# EAGLE design Control_Module_Schematic (EAGLE 7.3.0)
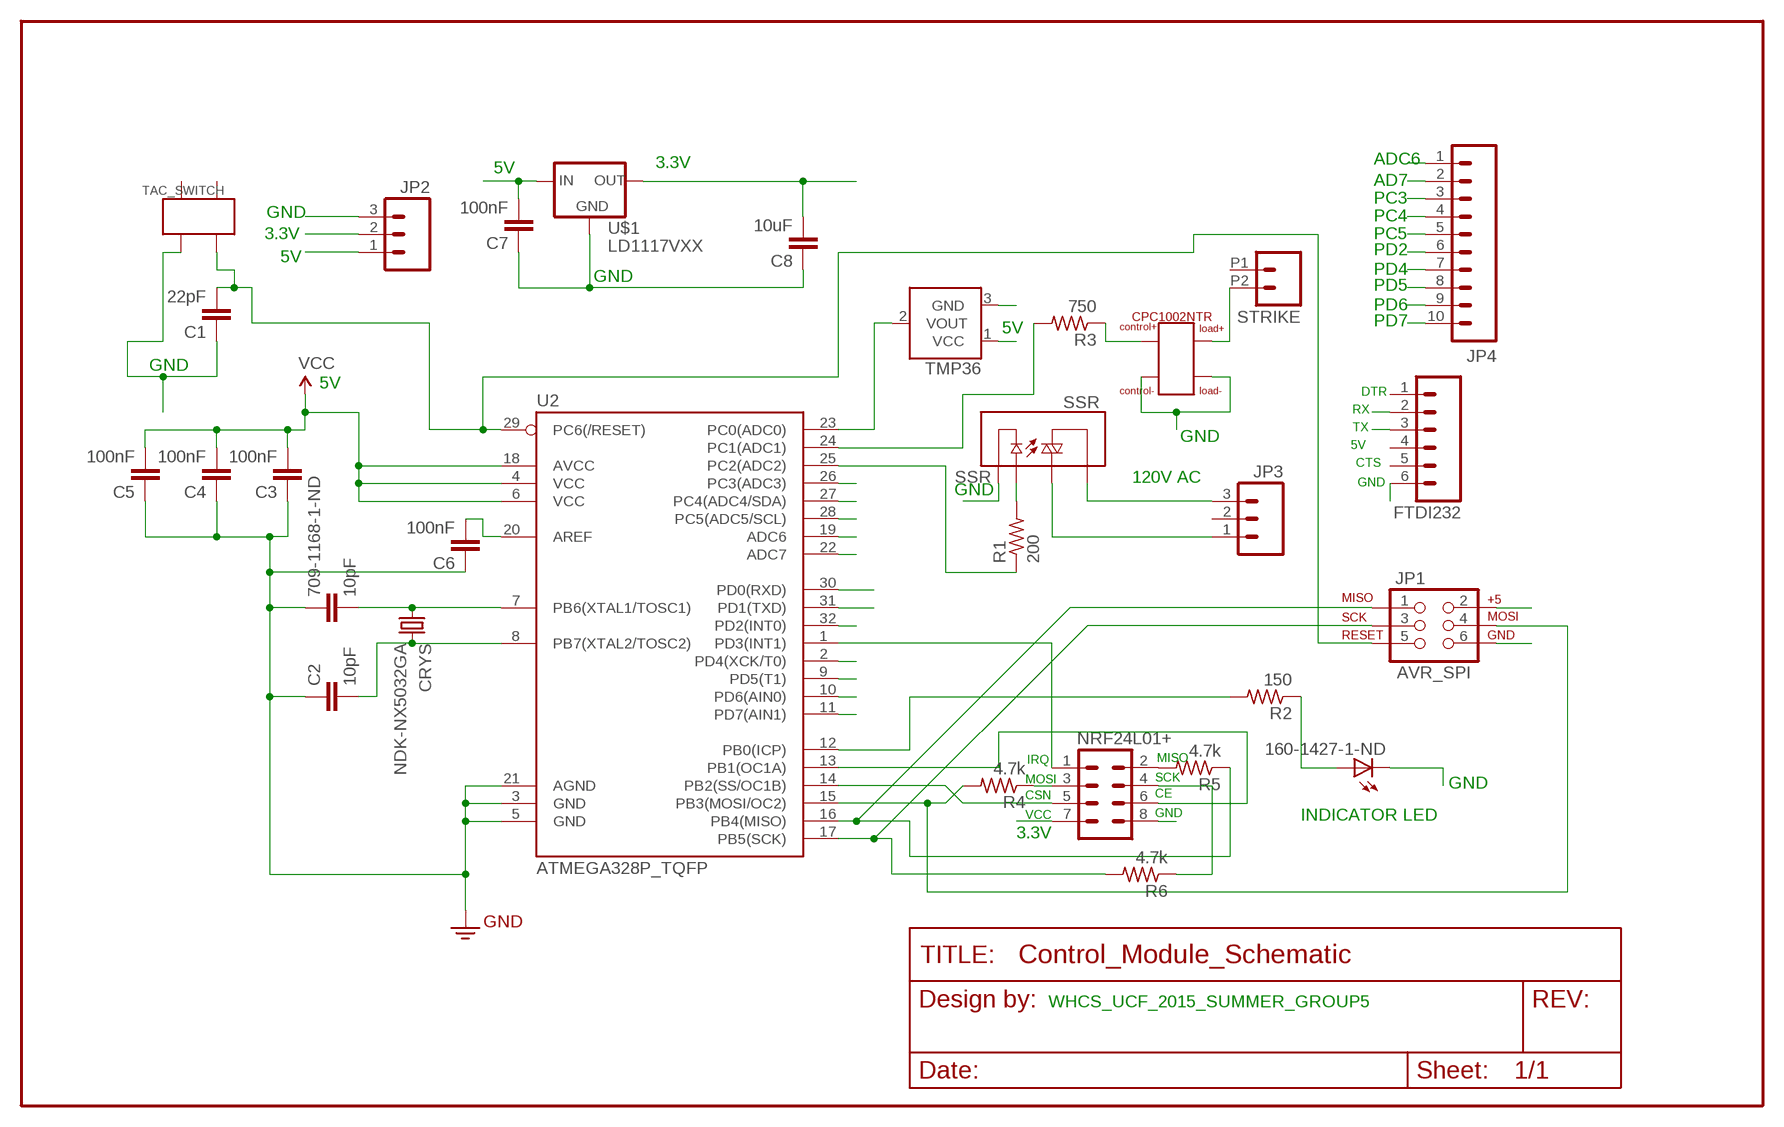
[diagram p0: schematic, sheet 1]

## Parts
160-1427-1-ND  LEDCHIP-LED0805  [CHIP-LED0805]
709-1168-1-ND  10pF  1UF-25V-10%(0805)"  [0805-CAP]
C1  22pF  1UF-25V-10%(0805)"  [0805-CAP]
C2  10pF  1UF-25V-10%(0805)"  [0805-CAP]
C3  100nF  1UF-25V-10%(0805)"  [0805-CAP]
C4  100nF  1UF-25V-10%(0805)"  [0805-CAP]
C5  100nF  1UF-25V-10%(0805)"  [0805-CAP]
C6  100nF  1UF-25V-10%(0805)"  [0805-CAP]
C7  100nF  1UF-25V-10%(0805)"  [0805-CAP]
C8  10uF  1UF-25V-10%(0805)"  [0805-CAP]
CPC1002NTR  CPC1002NTR  [CPC1002N]
CRYS  NDK-NX5032GA  [CRYS-5X3.2]
FRAME1  FRAME-LETTERNO_PACKAGE  [DUMMY]
FTDI232  M06LONGPADS  [1X06_LONGPADS]
JP1  AVR_SPI  AVR_SPI_PRG_6NS  [2X3-NS]
JP2  M03-SCREW-5MM  [SCREWTERMINAL-5MM-3]
JP3  M03-SCREW-5MM  [SCREWTERMINAL-5MM-3]
JP4  M10LOCK_LONGPADS  [1X10_LOCK_LONGPADS]
NRF24L01+  M04X2  [2X4]
R1  200  R-US_R0805  [R0805]
R2  150  R-US_R0805  [R0805]
R3  750  R-US_R0805  [R0805]
R4  4.7k  R-US_R0805  [R0805]
R5  4.7k  R-US_R0805  [R0805]
R6  4.7k  R-US_R0805  [R0805]
SSR  SSR  RELAY-SOLIDSTATE  [RELAY-S116S02F]
STRIKE  M022.54MM_SCREWTERM  [1X02_2.54_SCREWTERM]
TAC_SWITCH  TACTILE_SWITCH  [TAC_SWITCH_GULL_WING]
TMP36  TMP36TO-92-KIT  [TO-92-KIT]
U2  ATMEGA328P_TQFP  [TQFP32-08]
U$1  LD1117VXX  V_REG_LD1117VXX  [78XXL]

## Nets
3.3V: C8.2 JP2.2 NRF24L01+.7 U$1.OUT
5V: C3.2 C4.2 C5.2 C7.2 JP1.2 JP2.1 TMP36.1(VCC) U2.4(VCC) U2.6(VCC) U2.18(AVCC) U$1.IN ; supply symbol labelled VCC
ADC6: JP4.1 U2.19(ADC6)
ADC7: JP4.2 U2.22(ADC7)
GND: 160-1427-1-ND.C 709-1168-1-ND.1 C1.1 C2.1 C3.1 C4.1 C5.1 C6.1 C7.1 C8.1 CPC1002NTR.P$1 CPC1002NTR.P$4 FTDI232.6 JP1.6 JP2.3 NRF24L01+.8 SSR.P$4(-) TAC_SWITCH.P$2 TMP36.3(GND) U2.3(GND) U2.5(GND) U2.21(AGND) U$1.GND ; supply symbol labelled GND2
N$1: NRF24L01+.5 U2.14(PB2(SS/OC1B))
N$2: JP1.1 R5.1 U2.16(PB4(MISO))
N$3: JP1.4 R4.2 U2.15(PB3(MOSI/OC2))
N$4: JP1.3 R6.2 U2.17(PB5(SCK))
N$5: NRF24L01+.1 U2.1(PD3(INT1))
N$6: NRF24L01+.6 U2.13(PB1(OC1A))
N$7: TMP36.2(VOUT) U2.23(PC0(ADC0))
N$8: R1.2 SSR.P$3(+)
N$9: R1.1 U2.25(PC2(ADC2))
N$10: JP3.3 SSR.P$1(T1)
N$11: JP3.1 SSR.P$2(T2)
N$12: R3.2 U2.24(PC1(ADC1))
N$13: CPC1002NTR.P$2(CONTROL+) R3.1
N$14: 709-1168-1-ND.2 CRYS.P$1 U2.7(PB6(XTAL1/TOSC1))
N$15: C2.2 CRYS.P$2 U2.8(PB7(XTAL2/TOSC2))
N$16: R2.2 U2.12(PB0(ICP))
N$17: 160-1427-1-ND.A R2.1
N$18: CPC1002NTR.P$3 STRIKE.P2
N$20: NRF24L01+.3 R4.1
N$21: NRF24L01+.2 R5.2
N$22: NRF24L01+.4 R6.1
N$23: C6.2 U2.20(AREF)
N$24: C1.2 JP1.5 TAC_SWITCH.P$4 U2.29(PC6(/RESET))
PC3: JP4.3 U2.26(PC3(ADC3))
PC4: JP4.4 U2.27(PC4(ADC4/SDA))
PC5: JP4.5 U2.28(PC5(ADC5/SCL))
PD2: JP4.6 U2.32(PD2(INT0))
PD4: JP4.7 U2.2(PD4(XCK/T0))
PD5: JP4.8 U2.9(PD5(T1))
PD6: JP4.9 U2.10(PD6(AIN0))
PD7: JP4.10 U2.11(PD7(AIN1))
RXD: FTDI232.3 U2.30(PD0(RXD))
TXD: FTDI232.2 U2.31(PD1(TXD))
Unconnected: FTDI232.1 FTDI232.4 FTDI232.5 JP3.2 STRIKE.P1 TAC_SWITCH.P$1 TAC_SWITCH.P$3

## Notes on the sheet
- 3.3V | ADC6
- 5V
- AD7
- PC3
- GND | PC4
- 3.3V | PC5
- PD2
- 5V
- PD4
- GND
- PD5
- PD6
- PD7
- 5V
- GND
- 5V
- DTR
- RX
- TX
- GND
- 5V
- CTS
- 120V AC
- GND
- GND
- IRQ | MISO
- MOSI | SCK
- GND
- CSN | CE
- VCC | GND | INDICATOR LED
- 3.3V
- WHCS_UCF_2015_SUMMER_GROUP5

## Library data of the parts
160-1427-1-ND = led:LED: LED OSRAM: - CHIPLED LG R971, LG N971, LY N971, LG Q971, LY Q971, LO R971, LY R971 LH N974, LH R974 LS Q976, LO Q976, LY Q976 LO Q996 - Hyper CHIPLED LW Q18S LB Q993, LB Q99A, LB R99A - SideLED LS A670, LO A670, LY A670, LG A670, LP A670 LB A673, LV A673, LT A673, LW A673 LH A674 LY A675 LS A676, LA A676, LO A676, LY A676, LW A676 LS A679, LY A679, LG A679 - Hyper Micro SIDELED® LS Y876, LA Y876, LO Y876, LY Y876 LT Y87S - SmartLED LW L88C, LW L88S LB L89C, LB L89S, LG L890 LS L89K, LO L89K, LY L89K LS L896, LA L896, LO L896, LY L896 - TOPLED LS T670, LO T670, LY T670, LG T670, LP T670 LSG T670, LSP T670, LSY T670, LOP T670, LYG T670 LG T671, LOG T671, LSG T671 LB T673, LV T673, LT T673, LW T673 LH T674 LS T676, LA T676, LO T676, LY T676, LB T676, LH T676, LSB T676, LW T676 LB T67C, LV T67C, LT T67C, LS T67K, LO T67K, LY T67K, LW E67C LS E67B, LA E67B, LO E67B, LY E67B, LB E67C, LV E67C, LT E67C LW T67C LS T679, LY T679, LG T679 LS T770, LO T770, LY T770, LG T770, LP T770 LB T773, LV T773, LT T773, LW T773 LH T774 LS E675, LA E675, LY E675, LS T675 LS T776, LA T776, LO T776, LY T776, LB T776 LHGB T686 LT T68C, LB T68C - Hyper Mini TOPLED® LB M676 - Mini TOPLED Santana® LG M470 LS M47K, LO M47K, LY M47K Source: http://www.osram.convergy.de LUXEON: - LUMILED® LXK2-PW12-R00, LXK2-PW12-S00, LXK2-PW14-U00, LXK2-PW14-V00 LXK2-PM12-R00, LXK2-PM12-S00, LXK2-PM14-U00 LXK2-PE12-Q00, LXK2-PE12-R00, LXK2-PE12-S00, LXK2-PE14-T00, LXK2-PE14-U00 LXK2-PB12-K00, LXK2-PB12-L00, LXK2-PB12-M00, LXK2-PB14-N00, LXK2-PB14-P00, LXK2-PB14-Q00 LXK2-PR12-L00, LXK2-PR12-M00, LXK2-PR14-Q00, LXK2-PR14-R00 LXK2-PD12-Q00, LXK2-PD12-R00, LXK2-PD12-S00 LXK2-PH12-R00, LXK2-PH12-S00 LXK2-PL12-P00, LXK2-PL12-Q00, LXK2-PL12-R00 Source: www.luxeon.com KINGBRIGHT: KA-3528ASYC Source: www.kingbright.com
709-1168-1-ND C1-C8 = SparkFun-Capacitors:1UF-25V-10%(0805): CAP-08064
CPC1002NTR = WHCS:CPC1002NTR
CRYS = WHCS:NDK-NX5032GA
FRAME1 = WHCS:FRAME-LETTER: Schematic Frame Standard 8.5x11 US Letter frame; DESIGNER: Nobody; VERSION: v01
FTDI232 = SparkFun-Connectors:M06: Header 6 Standard 6-pin 0.1" header. Use with straight break away headers (SKU : PRT-00116), right angle break away headers (PRT-00553), swiss pins (PRT-00743), machine pins (PRT-00117), and female headers (PRT-00115). Molex polarized connector foot print use with SKU : PRT-08094 with associated crimp pins and housings. NOTES ON THE VARIANTS LOCK and LOCK_LONGPADS... This footprint was designed to help hold the alignment of a through-hole component (i.e. 6-pin header) while soldering it into place. You may notice that each hole has been shifted either up or down by 0.005 of an inch from it's more standard position (which is a perfectly straight line). This slight alteration caused the pins (the squares in the middle) to touch the edges of the holes. Because they are alternating, it causes a "brace" to hold the component in place. 0.005 has proven to be the perfect amount of "off-center" position when using our standard breakaway headers. Although looks a little odd when you look at the bare footprint, once you have a header in there, the alteration is very hard to notice. Also,if you push a header all the way into place, it is covered up entirely on the bottom side. This idea of altering the position of holes to aid alignment will be further integrated into the Sparkfun Library for other footprints. It can help hold any component with 3 or more connection pins.
JP1 = SparkFun-Connectors:AVR_SPI_PRG_6: AVR ISP 6 Pin This is the reduced ISP connector for AVR programming. Common on Arduino. This footprint will take up less PCB space and can be used with a 10-pin to 6-pin adapter such as SKU: BOB-08508 **Special note about "TEST_POINT" package. The stop mask is on the top side, so if you want your programming test points to be on the bottom of your board, make sure to place this package on the bottom side of the board. This also ensure that the orientation to program from the bottom side will be correct.
JP2 JP3 = SparkFun-Connectors:M03: Header 3 Standard 3-pin 0.1" header. Use with straight break away headers (SKU : PRT-00116), right angle break away headers (PRT-00553), swiss pins (PRT-00743), machine pins (PRT-00117), and female headers (PRT-00115). Molex polarized connector foot print use with SKU : PRT-08232 with associated crimp pins and housings.; STOREFRONT_ID: PRT-08433
JP4 = SparkFun-Connectors:M10: Header 10 Standard 10-pin 0.1" header. Use with straight break away headers (SKU : PRT-00116), right angle break away headers (PRT-00553), swiss pins (PRT-00743), machine pins (PRT-00117), and female headers (PRT-00115).
NRF24L01+ = SparkFun-Connectors:M04X2: .1" header, two rows of four.
R1-R6 = rcl:R-US_: RESISTOR, American symbol
SSR = WHCS:RELAY-SOLIDSTATE: SPST SS relay
STRIKE = SparkFun-Connectors:M02: Standard 2-pin 0.1" header. Use with - straight break away headers ( PRT-00116) - right angle break away headers (PRT-00553) - swiss pins (PRT-00743) - machine pins (PRT-00117) - female headers (PRT-00115) Molex polarized connector foot print use with: PRT-08233 with associated crimp pins and housings. 2.54_SCREWTERM for use with PRT-10571. 3.5mm Screw Terminal footprints for PRT-08084 5mm Screw Terminal footprints for use with PRT-08432
TAC_SWITCH = WHCS:TACTILE_SWITCH
TMP36 = SparkFun-Sensors:TMP36: Precision degC temp sensor, analog out
U2 = SparkFun-DigitalIC:ATMEGA328P_TQFP; PROD_ID: IC-09069
U$1 = SparkFun-PowerIC:V_REG_LD1117VXX: LD1117VXX voltage regulator. We carry the 3.3V version (COM-00526) in TO-220 package.

## Net classes
0 default: width 0.254 mm

## Board
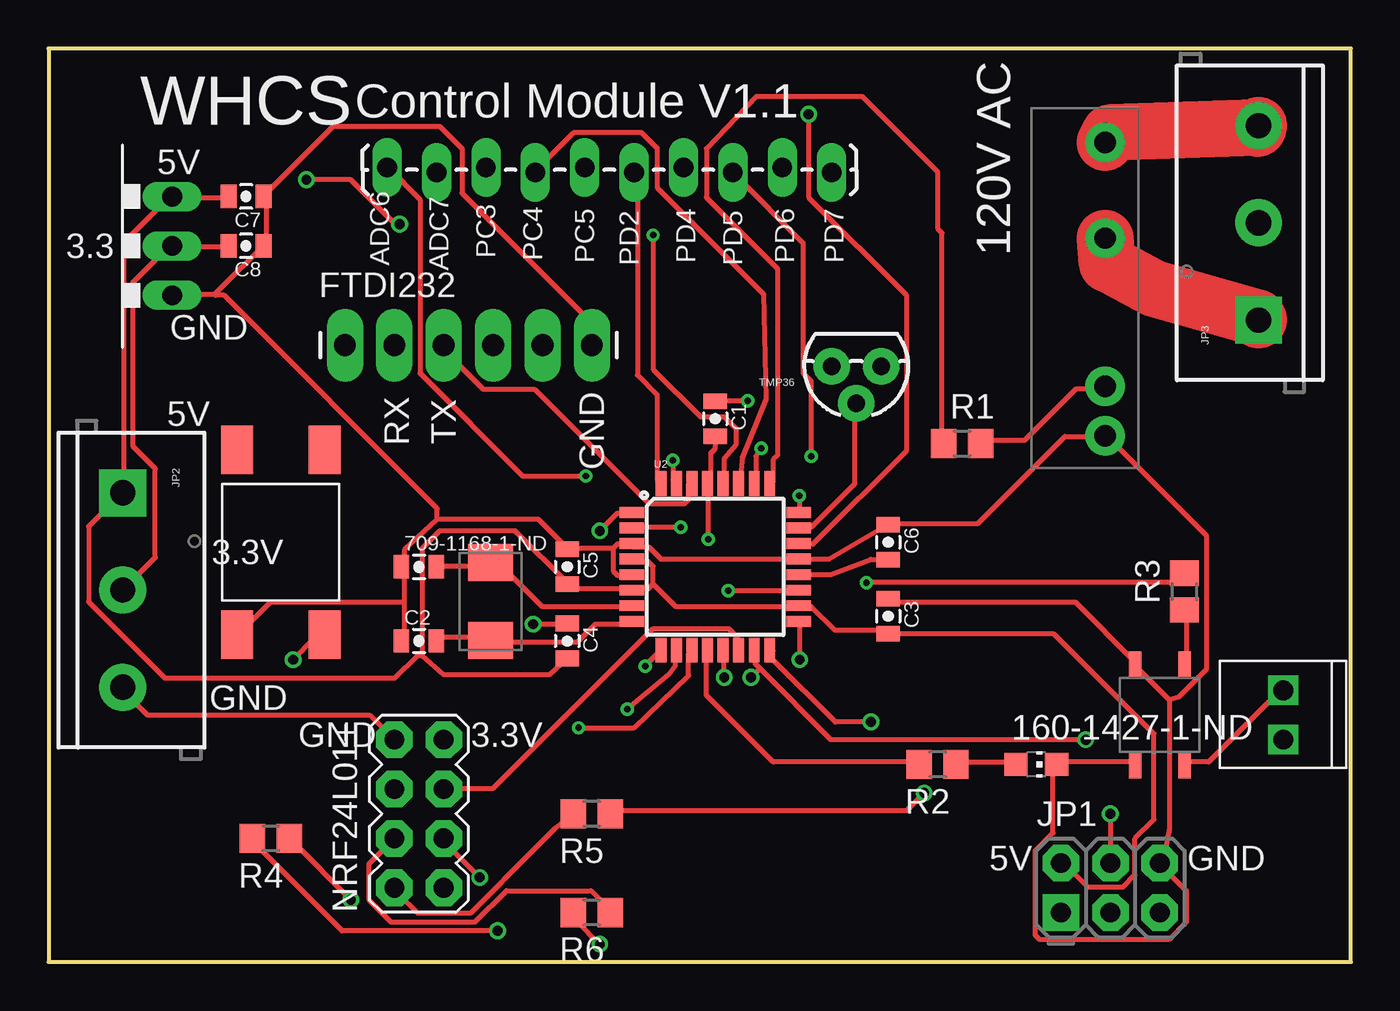
[diagram p1: board, top side]
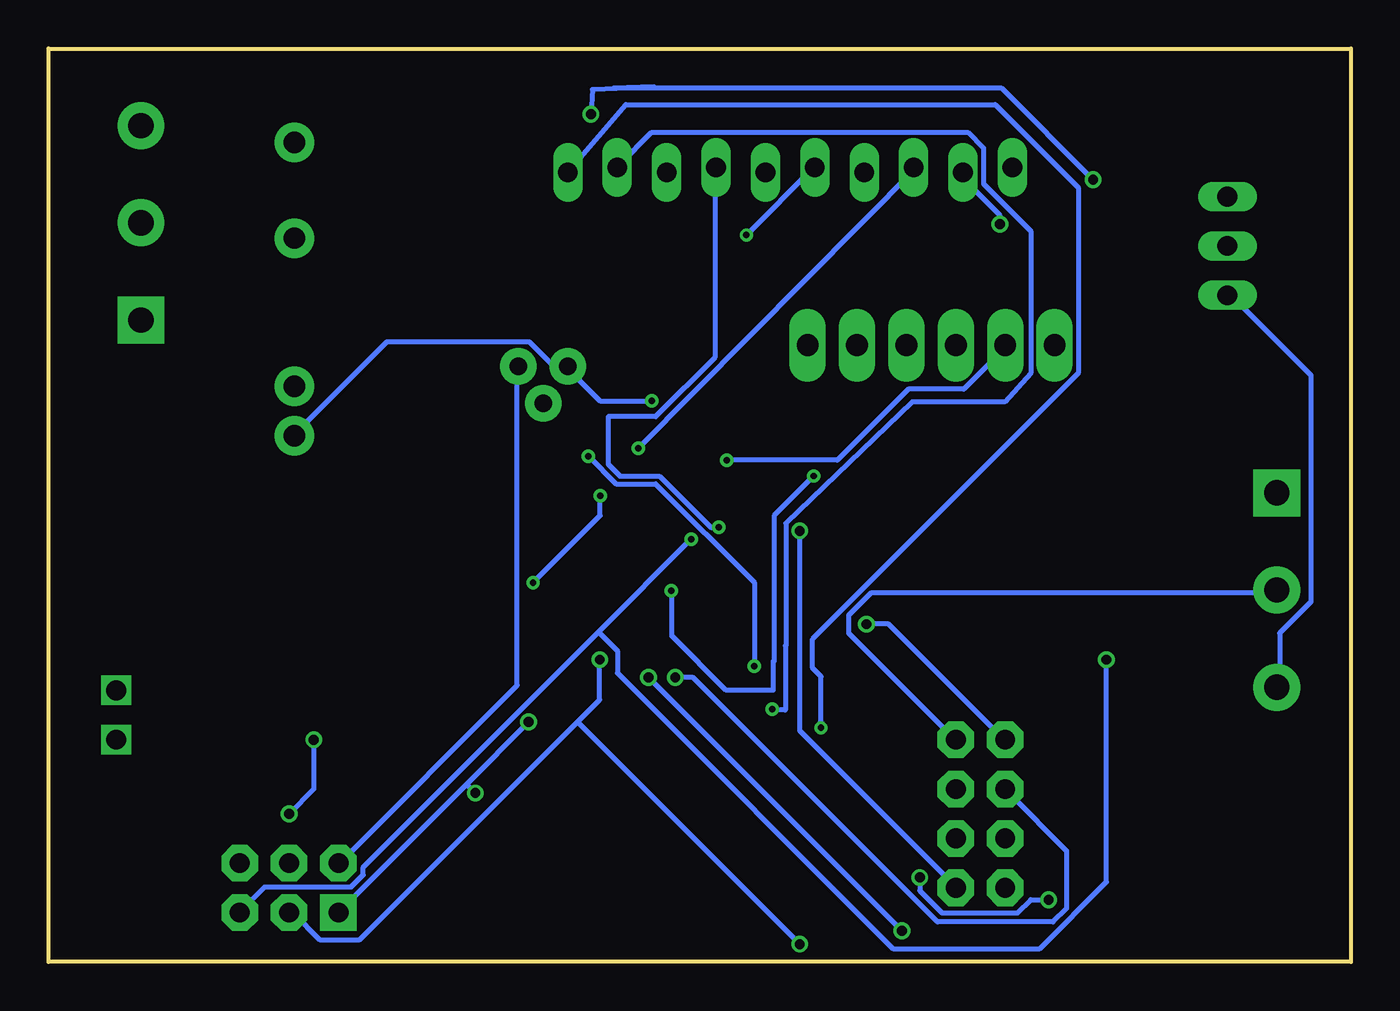
[diagram p2: board, bottom side, seen from below]

Size 66.98 x 46.98 mm. Coordinates in mm from the lower left corner, seen from the top.
Outline: 0,0 66.98,0 66.98,46.98 0,46.98 0,0
Copper layers (1*16): Top 0.0356mm / dielectric 1.5011mm / Bottom 0.0356mm
Design rules "oshpark-2layer": minimum track width 6mil, minimum drill 13mil, track to track 6mil, track to pad 6mil, pad to pad 6mil, via to via 6mil, smd to smd 6mil, copper to edge 15mil, drill to drill 6mil, minimum pad ring 7mil, minimum via ring 7mil, stop-mask expansion 4mil, vias tented up to drill 0mil, thermal gap 10mil

### Footprints (pad centres in the part's own frame; a part is rotated, then mirrored left to right if it is on the bottom)
CHIP-LED0805 = smd 1.2 x 1.2: A 0,-1.05; C 0,1.05
0805-CAP = smd 0.8 x 1.2: 1 -0.9,0; 2 0.9,0
CPC1002N = smd 0.635 x 1.321: P$1 -1.27,2.603; P$2 1.27,2.603; P$3 1.27,-2.603; P$4 -1.27,-2.603
CRYS-5X3.2 = smd 1.9 x 2.3: P$1 -2,0; P$2 2,0
1X06_LONGPADS = drill 1.118 pad 1.88 long: 1 0,0; 2 2.54,0; 3 5.08,0; 4 7.62,0; 5 10.16,0; 6 12.7,0
2X3-NS = drill 1.016 pad 1.88 square: 1 -2.54,-1.27 | drill 1.016 pad 1.88 octagon: 2 -2.54,1.27; 3 0,-1.27; 4 0,1.27; 5 2.54,-1.27; 6 2.54,1.27
SCREWTERMINAL-5MM-3 = drill 1.3 pad 2.413 square: 1 0,0 | drill 1.3 pad 2.413: 2 5,0; 3 10,0
1X10_LOCK_LONGPADS = drill 1.016 long: 1 0,0.127; 2 2.54,-0.127; 3 5.08,0.127; 4 7.62,-0.127; 5 10.16,0.127; 6 12.7,-0.127; 7 15.24,0.127; 8 17.78,-0.127; 9 20.32,0.127; 10 22.86,-0.127
2X4 = drill 1.016 pad 1.88 octagon: 1 -3.81,-1.27; 2 -3.81,1.27; 3 -1.27,-1.27; 4 -1.27,1.27; 5 1.27,-1.27; 6 1.27,1.27; 7 3.81,-1.27; 8 3.81,1.27
R0805 = smd 1.3 x 1.5: 1 -0.95,0; 2 0.95,0
RELAY-S116S02F = drill 1.1 pad 2.032: P$1 -7.5,1.05; P$2 -2.57,1.05; P$3 5.05,1.05; P$4 7.59,1.05
1X02_2.54_SCREWTERM = drill 1.016 square: P1 2.54,0; P2 0,0
TAC_SWITCH_GULL_WING = smd 1.65 x 2.5: P$1 -2.25,4.75; P$2 -2.25,-4.75; P$3 2.25,4.75; P$4 2.25,-4.75
TO-92-KIT = drill 0.9 pad 1.88: 1 -1.27,0; 2 0,1.905; 3 1.27,0
TQFP32-08 = smd 1.27 x 0.559: 1 -4.293,2.8; 2 -4.293,2; 3 -4.293,1.2; 4 -4.293,0.4; 5 -4.293,-0.4; 6 -4.293,-1.2; 7 -4.293,-2; 8 -4.293,-2.8; 17 4.293,-2.8; 18 4.293,-2; 19 4.293,-1.2; 20 4.293,-0.4; 21 4.293,0.4; 22 4.293,1.2; 23 4.293,2; 24 4.293,2.8 | smd 0.559 x 1.27: 9 -2.8,-4.293; 10 -2,-4.293; 11 -1.2,-4.293; 12 -0.4,-4.293; 13 0.4,-4.293; 14 1.2,-4.293; 15 2,-4.293; 16 2.8,-4.293; 25 2.8,4.293; 26 2,4.293; 27 1.2,4.293; 28 0.4,4.293; 29 -0.4,4.293; 30 -1.2,4.293; 31 -2,4.293; 32 -2.8,4.293
78XXL = drill 1.016 long: GND -2.54,-3.81; IN 2.54,-3.81; OUT 0,-3.81

### Placement (x,y rotation side)
160-1427-1-ND  50.8,10.16 270 top
709-1168-1-ND  19.05,20.32 0 top
C1  34.29,27.94 270 top
C2  19.05,16.51 0 top
C3  43.18,17.78 270 top
C4  26.67,16.51 270 top
C5  26.67,20.32 270 top
C6  43.18,21.59 270 top
C7  10.16,39.37 180 top
C8  10.16,36.83 180 top
CPC1002NTR  57.15,12.7 0 top
CRYS  22.73,18.54 270 top
FRAME1  0,-1.27 0 top
FTDI232  15.24,31.72 0 top
JP1  54.61,3.81 0 top
JP2  3.81,24.13 270 top
JP3  62.23,33.02 90 top
JP4  17.41,40.74 0 top
NRF24L01+  19.05,7.62 90 top
R1  46.99,26.67 0 top
R2  45.72,10.16 180 top
R3  58.42,19.05 90 top
R4  11.43,6.35 180 top
R5  27.94,7.62 180 top
R6  27.94,2.54 180 top
SSR  53.29,34.66 270 top
STRIKE  63.5,13.97 270 top
TAC_SWITCH  11.94,21.59 0 top
TMP36  41.54,30.65 180 top
U2  34.29,20.32 0 top
U$1  2.54,36.83 90 top

### Tracks (layer width: path | path; a pad name or v marks a point on that pad's centre or on a via)
3.3V
  Top 0.254: C8.2 9.14,36.8 6.4,36.8 U$1.OUT 6.17,36.8 4.34,34.98 4.34,26.52 5.49,25.38 5.49,20.8 3.89,19.2 JP2.2
  Bottom 0.254: NRF24L01+.7 20.34,11.43 25.83,16.92 25.83,17.83 24.69,18.97 3.89,18.97 JP2.2
5V
  Top 0.254: C7.2 9.14,39.32 6.4,39.32 U$1.IN 6.17,39.32 3.89,37.03 3.89,24.23 JP2.1 3.66,24 2.06,22.4 2.06,18.52 5.97,14.61 17.8,14.61 18.97,15.77 19.2,15.77 | 19.2,15.77 20.32,14.78 25.76,14.78 C4.2 | 19.2,15.77 19.2,21.26 20.12,22.17 24,22.17 26.75,19.43 C5.2 26.75,19.2 29.95,19.2 U2.6 30.18,19.2 30.86,19.2 31.09,19.43 | 31.09,19.43 31.09,20.34 30.86,20.57 30.18,20.57 U2.4 | 31.09,19.43 32.23,18.29 38.41,18.29 U2.18 38.61,18.29 39.22,18.29 40.44,17.07 43.08,17.07 C3.2 43.28,16.87 51.71,16.87 56.84,11.73 56.84,7.32 55.88,6.35 55.88,4.47 55.27,3.86 53.44,3.86 52.22,5.08 JP1.2
  Bottom 0.254: TMP36.1 42.88,30.48 42.88,14.22 52.02,5.08 JP1.2
ADC6  (via drill 0.33)
  Top 0.254: v34.95,19.1 38.41,19.1 U2.19 | v27.64,24.99 24.38,24.99 19.1,30.28 19.1,39.22 17.48,40.84 JP4.1
  Bottom 0.254: v27.64,24.99 29.67,22.96 29.67,15.47 29.72,15.47 29.72,13.97 32.13,13.97 34.92,16.76 34.92,19.07 v34.95,19.1
ADC7  (via drill 0.51)
  Top 0.254: v39.09,43.61 39.09,39.32 44.12,34.29 44.12,26.29 39.32,21.49 38.63,21.49 U2.22 | v13.26,40.23 15.54,40.23 17.83,37.95 v18.06,37.95
  Bottom 0.254: v39.09,43.61 39.01,44.88 35.84,45.01 37.95,44.93 17.96,44.93 v13.26,40.23 | v18.06,37.95 18.06,38.41 20.12,40.46 JP4.2
GND  (via drill 0.33, 0.51)
  Top 0.254: CPC1002NTR.P$4 55.78,10.29 51.89,10.29 160-1427-1-ND.C 51.66,10.06 51.66,6.63 50.75,5.71 50.75,1.37 50.98,1.14 57.61,1.14 58.52,2.06 58.52,3.66 57.15,5.03 JP1.6 57.3,5.08 57.56,6.45 57.63,6.78 57.63,13.49 | 18.29,18.52 18.29,20.12 709-1168-1-ND.1 18.29,20.32 18.29,21.18 19.99,22.76 | 18.29,18.52 18.29,16.69 C2.1 | 29.03,21.26 26.75,21.26 C5.1 26.62,21.34 25.2,22.76 19.99,22.76 | 29.03,21.26 29.26,21.49 29.95,21.49 U2.3 30.07,21.34 30.89,21.34 31.5,20.73 38.41,20.73 U2.21 40.14,20.72 C6.1 43.28,22.55 47.8,22.55 52.27,27.03 54.25,27.03 SSR.P$4 54.46,27.03 59.54,21.95 59.54,15.04 58.12,13.61 57.63,13.49 | 29.03,21.26 29.03,20.12 29.26,19.89 29.95,19.89 U2.5 | v24.92,17.37 26.52,17.37 C4.1 | JP2.3 3.89,13.95 3.89,13.89 5.08,12.7 16.51,12.7 NRF24L01+.8 17.6,11.43 | C3.1 43.28,18.49 52.83,18.49 55.88,15.44 CPC1002NTR.P$1 55.88,15.24 57.63,13.49 | v35.97,28.85 34.34,28.85 34.29,28.8 C1.1 | 8.53,34.34 8.93,34.73 | 8.93,34.73 10.97,36.78 C8.1 11.2,37.03 11.2,39.32 C7.1 11.2,39.55 14.63,42.98 20.12,42.98 21.26,41.83 21.26,39.55 27.89,32.92 27.89,31.77 FTDI232.6 | 8.53,34.34 6.5,34.34 U$1.GND | 18.29,18.52 11.43,18.52 9.83,16.92 TAC_SWITCH.P$2 | 8.91,34.75 8.93,34.73 | 19.99,22.76 19.99,23.32 9.02,34.29 8.59,34.29 8.53,34.34
  Bottom 0.254: v24.92,17.37 23.77,17.37 17.83,11.43 NRF24L01+.8 | JP2.3 3.66,14.17 3.66,16.92 2.06,18.52 2.06,30.18 6.17,34.29 U$1.GND | v35.97,28.85 38.61,28.85 40.23,30.48 TMP36.3 40.44,30.68 41.05,30.68 42.27,31.9 49.58,31.9 54.25,27.23 SSR.P$4
N$1
  Top 0.254: U2.14 35.43,16.23 35.43,16.69 34.98,17.14 31.09,17.14 22.86,8.91 20.34,8.91 NRF24L01+.5
N$2  (via drill 0.51)
  Top 0.254: v42.29,12.34 40.46,12.34 37.26,15.54 37.26,16 U2.16 | v45.03,8.69 44.12,7.77 29.03,7.77 R5.1
  Bottom 0.254: 45.49,9.14 51.89,2.74 JP1.1 | 45.49,9.14 v42.29,12.34 | 45.49,9.14 v45.03,8.69
N$3  (via drill 0.51)
  Top 0.254: 36.58,15.09 40.23,11.43 v53.34,11.43 | 36.58,15.09 36.35,15.32 36.35,16 U2.15 | 54.63,5.26 JP1.4 v54.61,7.62 | v23.09,1.6 15.09,1.6 10.52,6.17 R4.2 | 36.58,15.09 v36.12,14.63
  Bottom 0.254: v36.12,14.63 v23.09,1.6 | v53.34,11.43 53.34,8.89 v54.61,7.62
N$4  (via drill 0.51)
  Top 0.254: v38.63,15.54 38.63,17.37 U2.17 | v28.35,0.91 27.2,2.06 27.2,2.52 R6.2
  Bottom 0.254: v38.63,15.54 38.63,13.49 39.78,12.34 | 39.78,12.34 50.98,1.14 53.03,1.14 54.41,2.52 JP1.3 | 39.78,12.34 v28.35,0.91
N$5  (via drill 0.51)
  Top 0.254: v28.35,22.17 29.26,23.09 29.95,23.09 U2.1
  Bottom 0.254: v28.35,22.17 28.35,11.89 20.34,3.89 NRF24L01+.1
N$6  (via drill 0.51)
  Top 0.254: v34.75,14.63 34.75,16 U2.13
  Bottom 0.254: v34.75,14.63 33.83,14.63 21.26,2.06 15.32,2.06 14.63,2.74 14.63,5.71 17.6,8.69 NRF24L01+.6
N$7
  Top 0.254: U2.23 38.61,22.35 39.22,22.35 41.45,24.59 41.45,28.65 TMP36.2
N$8
  Top 0.254: R1.2 47.95,26.82 50.19,26.82 52.83,29.46 54.25,29.46 SSR.P$3
N$9
  Top 0.254: U2.25 37.26,24.69 37.26,25.83 37.49,26.06 37.49,35.66 33.83,39.32 33.83,41.83 36.4,44.53 41.83,44.53 45.72,40.64 45.72,37.72 45.95,37.49 45.95,26.75 R1.1
N$10
  Top 0.254: 62.18,42.88 62.2,42.9
  Top 2.921: 62.2,42.9 54.59,42.65 SSR.P$1 | 62.18,42.88 JP3.3
N$11
  Top 2.921: SSR.P$2 54.46,35.92 56.84,34.65 62.18,33.12 JP3.1
N$12  (via drill 0.33)
  Top 0.254: v38.61,23.98 38.61,23.16 U2.24 | v42.06,19.51 57.91,19.51 58.32,19.91 R3.2
  Bottom 0.254: v38.61,23.98 38.61,22.96 v42.06,19.51
N$13
  Top 0.254: CPC1002NTR.P$2 58.52,15.32 58.52,18.06 R3.1
N$14
  Top 0.254: 22.86,20.8 22.4,20.34 20.12,20.34 709-1168-1-ND.2 | 22.86,20.8 25.38,18.29 29.95,18.29 U2.7 | 22.86,20.8 CRYS.P$1
N$15
  Top 0.254: 22.86,17.14 22.4,16.69 20.12,16.69 C2.2 | 22.86,17.14 23.55,16.46 27.2,16.46 28.12,17.37 29.95,17.37 U2.8 | 22.86,17.14 CRYS.P$2
N$16
  Top 0.254: U2.12 33.83,16 33.83,13.72 37.26,10.29 44.58,10.29 R2.2
N$17
  Top 0.254: 160-1427-1-ND.A 49.61,10.29 46.86,10.29 R2.1
N$18
  Top 0.254: CPC1002NTR.P$3 58.52,10.29 59.66,10.29 63.32,13.95 STRIKE.P2
N$20  (via drill 0.51)
  Top 0.254: v15.54,3.2 12.57,6.17 R4.1 | v22.17,4.34 20.34,6.17 NRF24L01+.3
  Bottom 0.254: v15.54,3.2 16.46,3.2 17.14,2.52 21.03,2.52 22.17,3.66 v22.17,4.34
N$21
  Top 0.254: R5.2 26.09,6.91 23.42,4.24 23.32,4.12 21.72,2.52 18.97,2.52 17.83,3.66 NRF24L01+.2
N$22
  Top 0.254: NRF24L01+.4 16.46,5.03 16.46,3.2 17.6,2.06 21.95,2.06 23.55,3.66 27.89,3.66 28.8,2.74 R6.1
N$23
  Top 0.254: U2.20 40.24,19.92 42.29,20.7 43.17,20.7 C6.2
N$24  (via drill 0.33, 0.51)
  Top 0.254: v33.93,21.74 33.93,24.59 U2.29 34.06,24.69 34.06,26.19 34.29,26.42 C1.2 | v12.57,15.54 13.72,16.69 14.17,16.69 TAC_SWITCH.P$4
  Bottom 0.254: 38.7,16.98 50.8,4.88 50.8,4.47 51.41,3.86 55.88,3.86 57.1,2.64 JP1.5 | 38.7,16.98 v33.93,21.74 | v12.57,15.54 12.57,4.12 16,0.69 23.55,0.69 37.72,14.86 37.72,16 38.7,16.98
PC3  (via drill 0.33)
  Top 0.254: v36.65,26.42 36.37,26.01 36.37,24.79 U2.26
  Bottom 0.254: v36.65,26.42 22.35,40.84 JP4.3
PC4
  Top 0.254: U2.27 35.56,24.79 35.69,25.96 36.91,28.96 36.78,34.34 31.29,39.83 31.29,41.86 30.48,42.67 27.03,42.67 24.99,40.64 JP4.4
PC5  (via drill 0.33)
  Top 0.254: v31.09,37.39 31.09,30.48 33.53,28.04 34.75,28.04 35.36,27.43 35.36,26.62 34.75,25.88 34.75,24.79 U2.28
  Bottom 0.254: v31.09,37.39 27.64,40.84 JP4.5
PD2
  Top 0.254: U2.32 31.29,24.79 31.29,29.16 30.28,30.18 30.28,40.44 JP4.6
PD4  (via drill 0.33)
  Top 0.254: v32.51,22.35 30.07,22.35 U2.2
  Bottom 0.254: v32.51,22.35 32.92,22.35 35.56,24.99 37.59,24.99 38.2,25.6 38.2,28.04 35.76,28.04 32.72,31.09 32.72,40.84 JP4.7
PD5  (via drill 0.33)
  Top 0.254: v30.68,15.21 31.29,15.85 U2.9 | v39.22,26.01 39.22,29.87 38.81,30.28 38.81,36.98 35.36,40.44 JP4.8
  Bottom 0.254: v30.68,15.21 30.68,19.51 35.76,24.59 37.8,24.59 v39.22,26.01
PD6  (via drill 0.33)
  Top 0.254: v29.77,13.01 31.9,14.78 32.23,15.24 32.23,15.85 U2.10
  Bottom 0.254: JP4.9 37.59,41.05 35.97,42.67 19.71,42.67 18.9,41.86 18.9,40.03 16.46,37.59 16.46,30.28 17.8,28.8 22.55,28.8 29.06,22.55 29.06,16.26 29.08,16.26 29.08,12.95 29.77,12.95 v29.77,13.01
PD7  (via drill 0.33)
  Top 0.254: v27.25,12.04 30.1,12.04 32.92,14.73 32.92,15.85 U2.11
  Bottom 0.254: JP4.10 40.23,40.64 37.29,44.09 18.29,44.09 14.02,39.83 14.02,30.28 27.69,16.61 27.69,15.11 27.25,14.68 v27.25,12.04
RXD
  Top 0.254: FTDI232.3 20.32,31.5 22.35,29.46 24.99,29.46 30.89,23.57 32.72,23.57 32.92,23.77 32.92,24.59 U2.30
TXD  (via drill 0.33)
  Top 0.254: v32.11,25.81 32.11,24.79 U2.31
  Bottom 0.254: v32.11,25.81 26.42,25.81 22.76,29.46 19.91,29.46 17.68,31.7 FTDI232.2

### Text on the board
tPlace: WHCS | Control Module V1.1 | 5V | 3.3 | ADC6 | ADC7 | PC3 | PC4 | PC5 | PD2 | PD4 | PD5 | PD6 | PD7 | 120V AC | GND | RX | TX | GND | 5V | 3.3V | GND | GND | 3.3V | 5V | GND